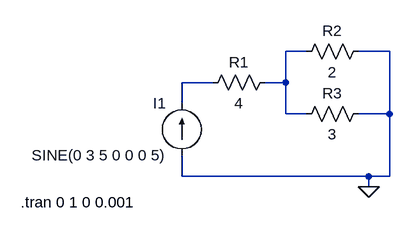
[diagram p0: schematic g2_p10.asc]
g2_p10.asc, the LTspice schematic file:
Version 4
SHEET 1 880 680
WIRE 224 112 192 112
WIRE 352 112 304 112
WIRE 80 160 32 160
WIRE 192 160 192 112
WIRE 192 160 160 160
WIRE 32 192 32 160
WIRE 192 208 192 160
WIRE 224 208 192 208
WIRE 352 208 352 112
WIRE 352 208 304 208
WIRE 32 304 32 272
WIRE 320 304 32 304
WIRE 352 304 352 208
WIRE 352 304 320 304
WIRE 320 320 320 304
FLAG 320 320 0
SYMBOL res 176 144 R90
WINDOW 0 0 56 VBottom 2
WINDOW 3 32 56 VTop 2
SYMATTR InstName R1
SYMATTR Value 4
SYMBOL res 320 96 R90
WINDOW 0 0 56 VBottom 2
WINDOW 3 32 56 VTop 2
SYMATTR InstName R2
SYMATTR Value 2
SYMBOL res 320 192 R90
WINDOW 0 0 56 VBottom 2
WINDOW 3 32 56 VTop 2
SYMATTR InstName R3
SYMATTR Value 3
SYMBOL current 32 272 R180
WINDOW 0 24 80 Left 2
WINDOW 3 24 0 Left 2
WINDOW 123 0 0 Left 0
WINDOW 39 0 0 Left 0
SYMATTR InstName I1
SYMATTR Value SINE(0 3 5 0 0 0 5)
TEXT -216 344 Left 2 !.tran 0 1 0 0.001

The netlist it stands for:
* g2_p10.asc
R1 N001 N002 4
R2 0 N001 2
R3 0 N001 3
I1 0 N002 SINE(0 3 5 0 0 0 5)
.tran 0 1 0 0.001
.backanno
.end